# EAGLE design rpi_shield (EAGLE 9.6.2)
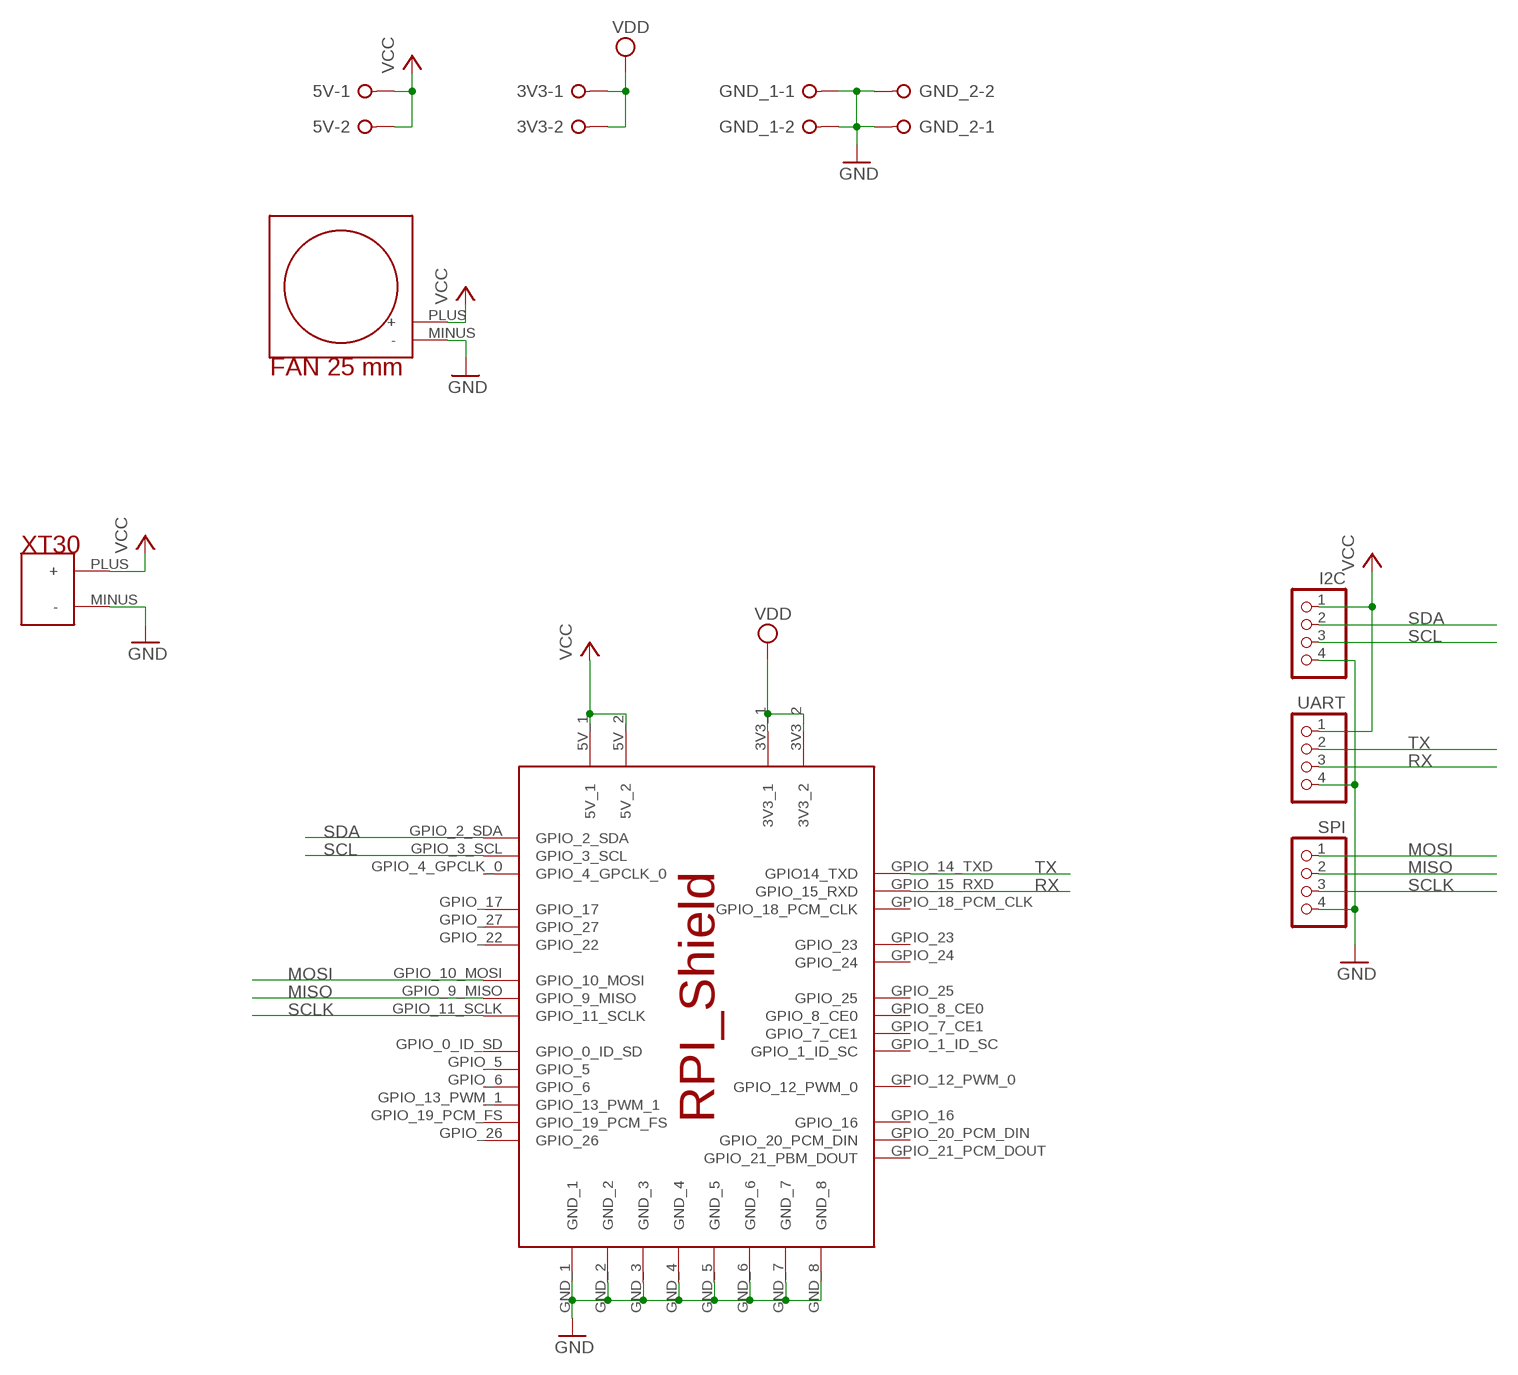
[diagram p0: schematic, sheet 1]

## Parts
3V3  W237-02P  [W237-132]
5V  W237-02P  [W237-132]
GND_1  W237-02P  [W237-132]
GND_2  W237-02P  [W237-132]
I2C  PINHD-1X4/90  [1X04/90]
SPI  PINHD-1X4/90  [1X04/90]
U$1  RPI_SHIELD  [RPI_SHIELD]
U$2  XT30_90DEG  [XT30_90DEG_FOOTPRINT]
U$3  FAN_25_MM  [FAN_25_MM]
UART  PINHD-1X4/90  [1X04/90]

## Nets
GND: GND_1.1 GND_1.2 GND_2.1 GND_2.2 I2C.4 SPI.4 U$1.GND_1 U$1.GND_2 U$1.GND_3 U$1.GND_4 U$1.GND_5 U$1.GND_6 U$1.GND_7 U$1.GND_8 U$2.MINUS(-) U$3.MINUS(-) UART.4
MISO: SPI.2 U$1.GPIO_9_MISO
MOSI: SPI.1 U$1.GPIO_10_MOSI
RX: U$1.GPIO_15_RXD UART.3
SCL: I2C.3 U$1.GPIO_3_SCL
SCLK: SPI.3 U$1.GPIO_11_SCLK
SDA: I2C.2 U$1.GPIO_2_SDA
TX: U$1.GPIO_14_TXD(GPIO14_TXD) UART.2
VCC: 5V.1 5V.2 I2C.1 U$1.5V_1 U$1.5V_2 U$2.PLUS(+) U$3.PLUS(+) UART.1
VDD: 3V3.1 3V3.2 U$1.3V3_1 U$1.3V3_2
Unconnected: U$1.GPIO_0_ID_SD U$1.GPIO_1_ID_SC U$1.GPIO_4_GPCLK_0 U$1.GPIO_5 U$1.GPIO_6 U$1.GPIO_7_CE1 U$1.GPIO_8_CE0 U$1.GPIO_12_PWM_0 U$1.GPIO_13_PWM_1 U$1.GPIO_16 U$1.GPIO_17 U$1.GPIO_18_PCM_CLK U$1.GPIO_19_PCM_FS U$1.GPIO_20_PCM_DIN U$1.GPIO_21_PCM_DOUT(GPIO_21_PBM_DOUT) U$1.GPIO_22 U$1.GPIO_23 U$1.GPIO_24 U$1.GPIO_25 U$1.GPIO_26 U$1.GPIO_27

## Library data of the parts
3V3 5V GND_1 GND_2 = con-wago-508:W237-02P: WAGO SREW CLAMP; OC_FARNELL: unknown; OC_NEWARK: unknown
I2C SPI UART = pinhead:PINHD-1X4: PIN HEADER
U$1 = rpi_shield:RPI_SHIELD
U$2 = XT_connectors:XT30_90DEG
U$3 = fans:FAN_25_MM

## Board
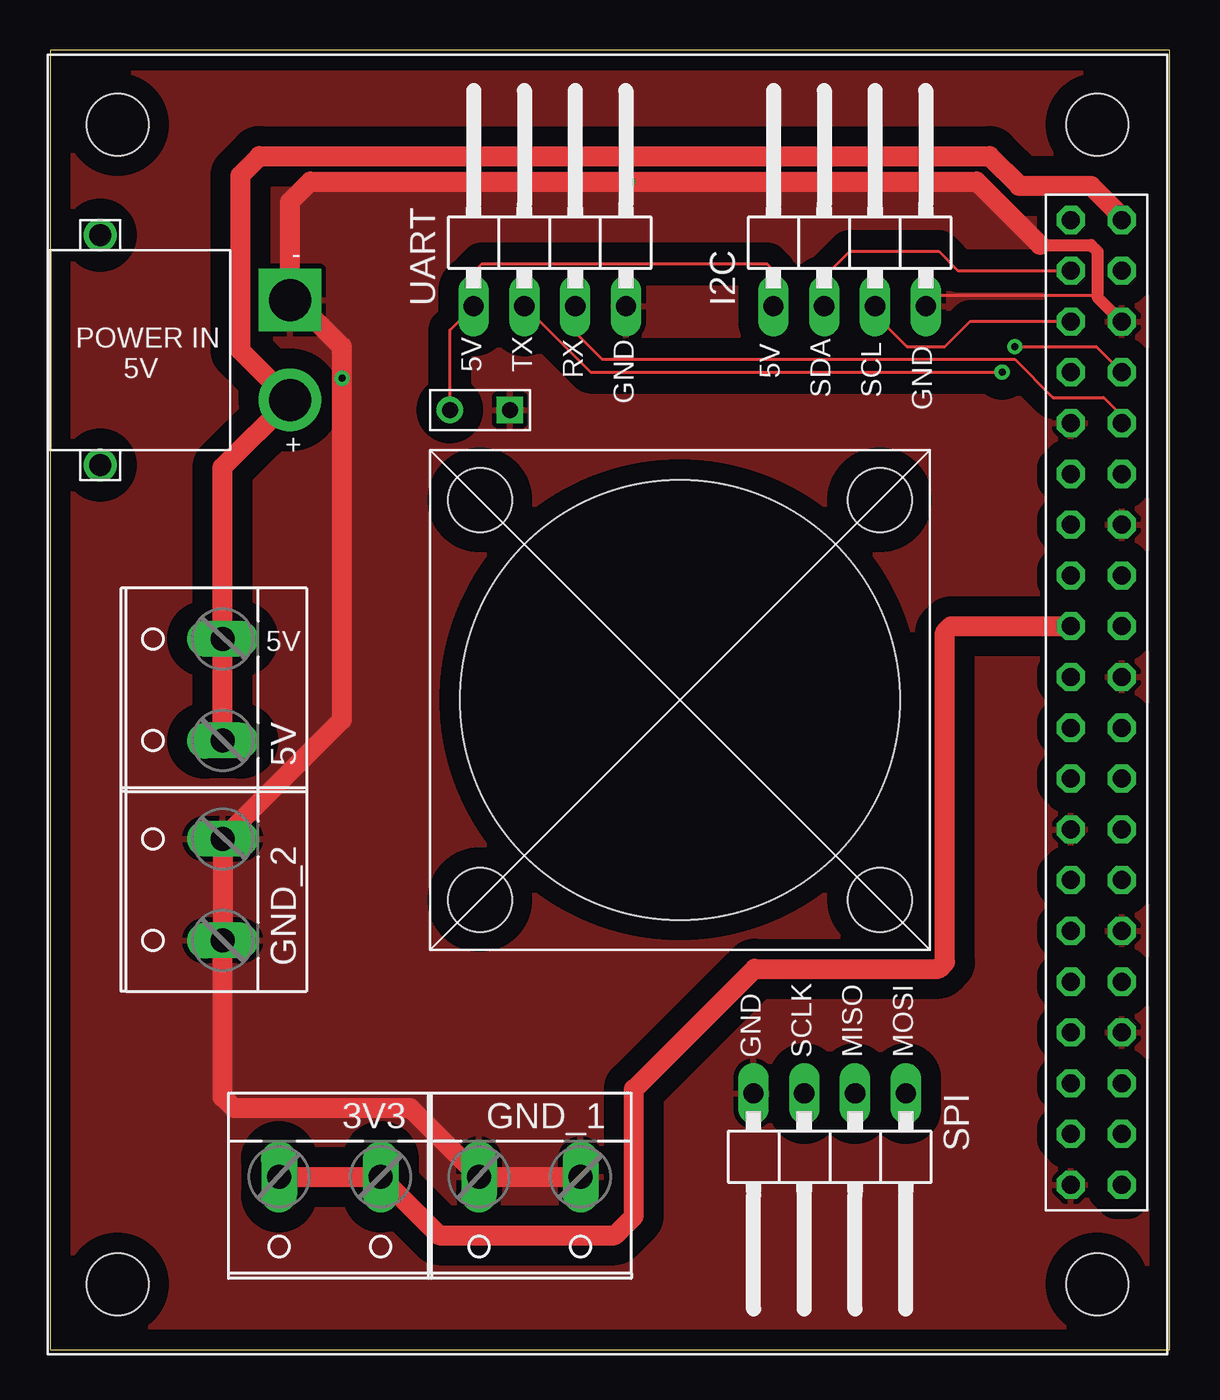
[diagram p1: board, top side]
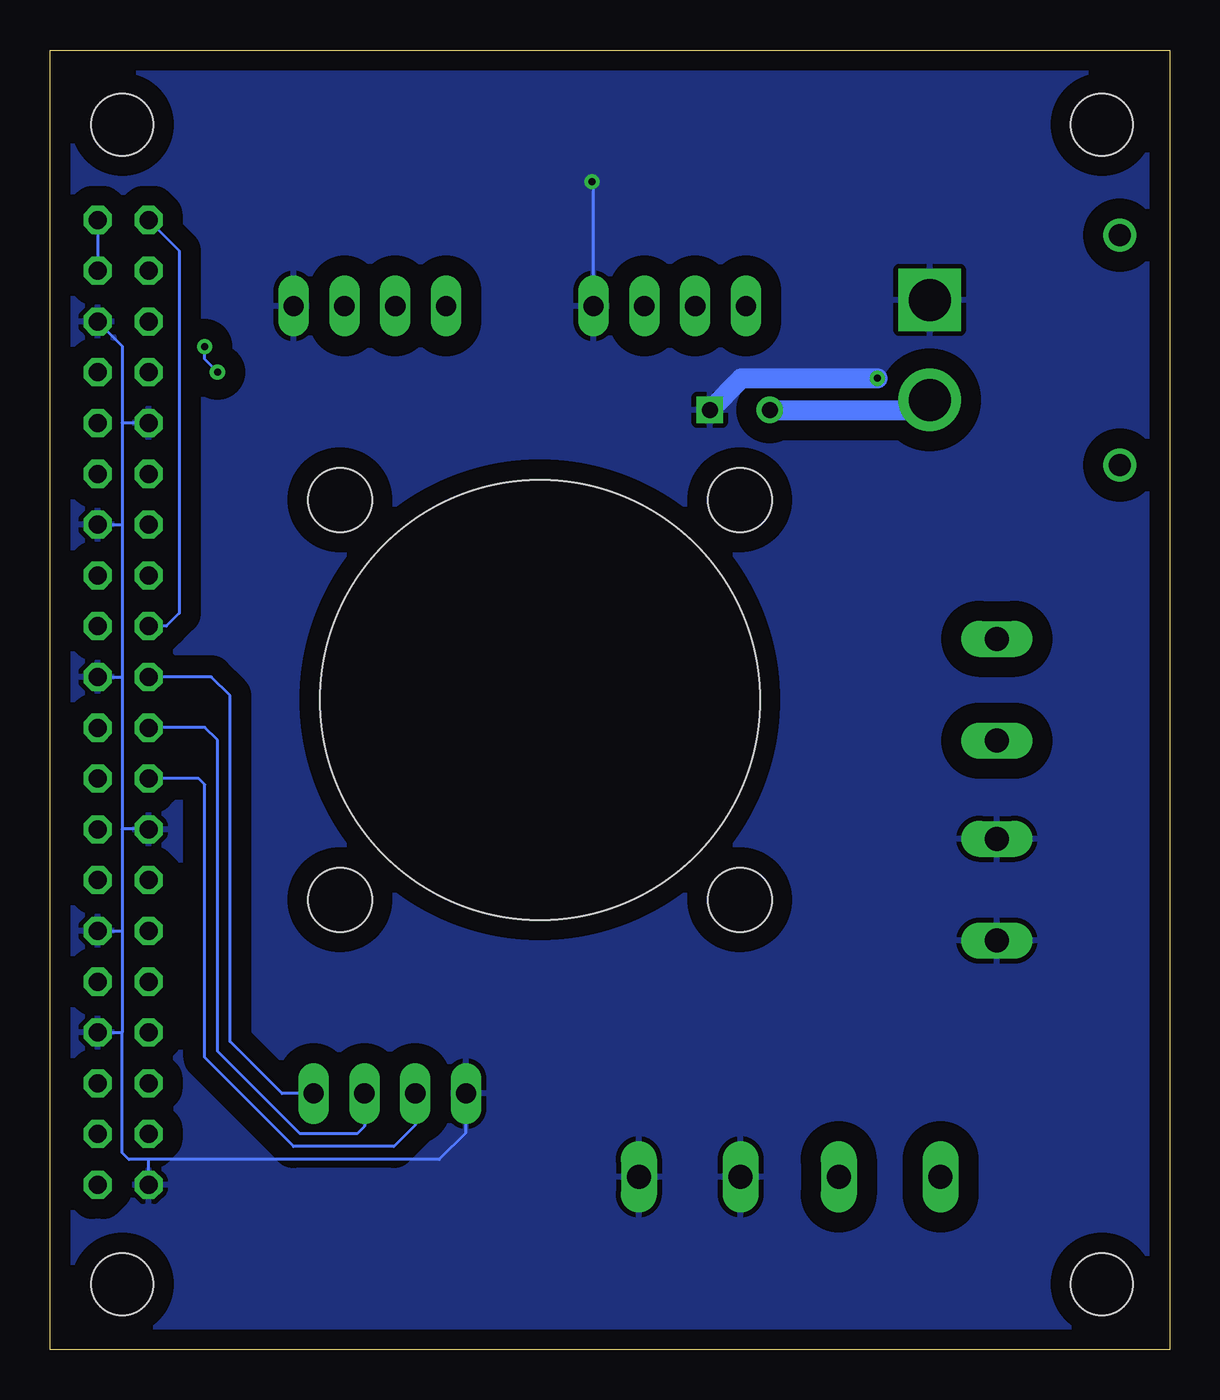
[diagram p2: board, bottom side, seen from below]

Size 56 x 65 mm. Coordinates in mm from the lower left corner, seen from the top.
Outline: 0,0 56,0 56,65 0,65 0,0
Copper layers (1*16): Top 0.035mm / dielectric 1.5mm / Bottom 0.035mm
Design rules "default": minimum track width 6mil, minimum drill 0.35mm, track to track 6mil, track to pad 6mil, pad to pad 6mil, via to via 6mil, smd to smd 6mil, copper to edge 40mil, drill to drill 6mil, minimum pad ring 10mil, minimum via ring 8mil, stop-mask expansion 4mil, vias tented up to drill 0mil, thermal gap 10mil

### Footprints (pad centres in the part's own frame; a part is rotated, then mirrored left to right if it is on the bottom)
W237-132 = drill 1.194 long: 1 -2.54,-0.635; 2 2.54,-0.635
1X04/90 = drill 1.016 long: 1 -3.81,-3.81; 2 -1.27,-3.81; 3 1.27,-3.81; 4 3.81,-3.81
RPI_SHIELD = drill 0.9 octagon: 3V3_1 51.07,36.18; 3V3_2 51.07,56.5; 5V_1 53.61,56.5; 5V_2 53.61,53.96; GND_1 53.61,51.42; GND_2 53.61,41.26; GND_3 53.61,33.64; GND_4 53.61,20.94; GND_5 53.61,15.86; GND_6 51.07,8.24; GND_7 51.07,26.02; GND_8 51.07,46.34; GPIO_0_ID_SD 51.07,23.48; GPIO_1_ID_SC 53.61,23.48; GPIO_2_SDA 51.07,53.96; GPIO_3_SCL 51.07,51.42; GPIO_4_GPCLK_0 51.07,48.88; GPIO_5 51.07,20.94; GPIO_6 51.07,18.4; GPIO_7_CE1 53.61,26.02; GPIO_8_CE0 53.61,28.56; GPIO_9_MISO 51.07,31.1; GPIO_10_MOSI 51.07,33.64; GPIO_11_SCLK 51.07,28.56; GPIO_12_PWM_0 53.61,18.4; GPIO_13_PWM_1 51.07,15.86; GPIO_14_TXD 53.61,48.88; GPIO_15_RXD 53.61,46.34; GPIO_16 53.61,13.32; GPIO_17 51.07,43.8; GPIO_18_PCM_CLK 53.61,43.8; GPIO_19_PCM_FS 51.07,13.32; GPIO_20_PCM_DIN 53.61,10.78; GPIO_21_PCM_DOUT 53.61,8.24; GPIO_22 51.07,38.72; GPIO_23 53.61,38.72; GPIO_24 53.61,36.18; GPIO_25 53.61,31.1; GPIO_26 51.07,10.78; GPIO_27 51.07,41.26 | hole 3.1: 52.38,61.27; 3.38,61.27; 3.38,3.27; 52.38,3.27
XT30_90DEG_FOOTPRINT = drill 2.1 square: MINUS 7.5,-3 | drill 1.1: NC1 -0.75,6.5; NC2 10.75,6.5 | drill 2.1: PLUS 2.5,-3
FAN_25_MM = drill 0.8 square: MINUS 4,27 | drill 0.8: PLUS 1,27 | hole 22: 12.5,12.5 | hole 3.2: 2.5,2.5; 22.5,2.5; 22.5,22.5; 2.5,22.5

### Placement (x,y rotation side)
3V3  14,8 180 top
5V  8,33 90 top
GND_1  24,8 180 top
GND_2  8,23 90 top
I2C  40,56 0 top
SPI  39,9 180 top
U$1  0,0 0 top
U$2  9,45 90 top
U$3  19,20 0 top
UART  25,56 0 top

### Tracks (layer width: path | path; a pad name or v marks a point on that pad's centre or on a via)
GND  (via drill 0.35)
  Top 0.152: U$1.GND_1 52.33,52.7 44.33,52.7 I2C.4
  Top 0.6: 49.53,55.24 52.07,55.24 52.39,54.93 52.39,52.64 U$1.GND_1
  Top 1: 49.53,55.24 46.35,58.42 v28.89,58.42 13.02,58.42 12,57.4 U$2.MINUS 12.27,52.5 14.61,50.16 v14.61,48.58 14.61,31.51 GND_2.2 GND_2.1 8.63,12.64 9.21,12.06 18.03,12.06 GND_1.2 GND_1.1
  Bottom 0.152: U$1.GND_1 52.39,50.2 52.39,46.35 | 52.39,46.35 52.39,41.27 | 52.39,41.27 52.39,33.66 | 52.39,33.66 52.39,26.04 | 52.39,26.04 52.39,20.95 | 52.39,20.95 52.39,15.88 | 52.39,15.88 52.39,9.84 52.05,9.51 51.12,9.51 | U$1.GND_8 52.37,46.34 52.39,46.35 | U$1.GND_2 52.4,41.26 52.39,41.27 | U$1.GND_3 52.4,33.64 52.39,33.66 | U$1.GND_7 51.09,26.04 52.39,26.04 | U$1.GND_4 52.4,20.94 52.39,20.95 | U$1.GND_5 52.4,15.86 52.39,15.88 | SPI.4 35.19,10.85 36.53,9.51 51.12,9.51 | UART.4 28.81,58.34 v28.89,58.42 | U$1.GND_6 51.07,9.46 51.12,9.51
  Bottom 1: U$3.MINUS 21.42,48.58 v14.61,48.58
  pour Bottom (isolate 1): 0,0 56,0 56,65 0,65
  pour Top (isolate 1): 0,65 56,65 56,0 0,0
MISO
  Bottom 0.152: SPI.2 40.27,11.16 40.64,10.79 43.5,10.79 47.62,14.92 47.62,30.48 48.26,31.11 51.05,31.11 U$1.GPIO_9_MISO
MOSI
  Bottom 0.152: SPI.1 44.4,12.81 46.99,15.4 46.99,32.7 47.93,33.64 U$1.GPIO_10_MOSI
RX
  Top 0.152: UART.3 26.35,52.11 26.35,50.8 27.62,49.53 48.26,49.53 50.16,47.62 52.7,47.62 53.61,46.72 U$1.GPIO_15_RXD
SCL
  Top 0.152: I2C.3 41.27,51.76 42.86,50.16 44.77,50.16 46.04,51.44 51.05,51.44 U$1.GPIO_3_SCL
SCLK
  Bottom 0.152: SPI.3 37.73,11.22 38.79,10.16 43.81,10.16 48.26,14.61 48.26,28.26 48.56,28.56 U$1.GPIO_11_SCLK
SDA
  Top 0.152: I2C.2 38.73,53.65 40.01,54.93 44.45,54.93 45.42,53.96 U$1.GPIO_2_SDA
TX  (via drill 0.35)
  Top 0.152: UART.2 27.02,48.9 v47.62,48.9 | v48.26,50.16 52.33,50.16 U$1.GPIO_14_TXD
  Bottom 0.152: v47.62,48.9 48.26,49.53 v48.26,50.16
VCC
  Top 0.152: U$3.PLUS 20,51 21.17,52.17 | 21.17,52.17 UART.1 | I2C.1 36.19,53.97 35.88,54.28 35.88,54.29 21.59,54.29 21.17,53.87 21.17,52.17
  Top 1: U$1.5V_1 53.61,56.66 52.07,58.2 48.48,58.2 46.99,59.69 10.48,59.69 9.53,58.74 9.53,49.98 U$2.PLUS 8.63,44.13 5V.2 5V.1
  Bottom 0.152: U$1.5V_1 U$1.5V_2
  Bottom 1: U$3.PLUS 12.5,47 U$2.PLUS
VDD
  Top 1: 3V3.2 3V3.1 19.46,5.71 28.26,5.71 29.21,6.67 29.21,13.02 35.24,19.05 44.45,19.05 44.77,19.37 44.77,35.88 45.07,36.18 U$1.3V3_1
  Bottom 0.152: U$1.3V3_2 49.53,54.96 49.53,36.83 50.18,36.18 U$1.3V3_1

### Text on the board
tPlace: - | POWER IN / 5V | 5V | TX | RX | 5V | SDA | SCL | GND | GND | + | 5V | GND | SCLK | MISO | MOSI